# Altium schematic sheet ADCS&breakout_Board FinalVesion.schdoc
size 319 x 216 mm
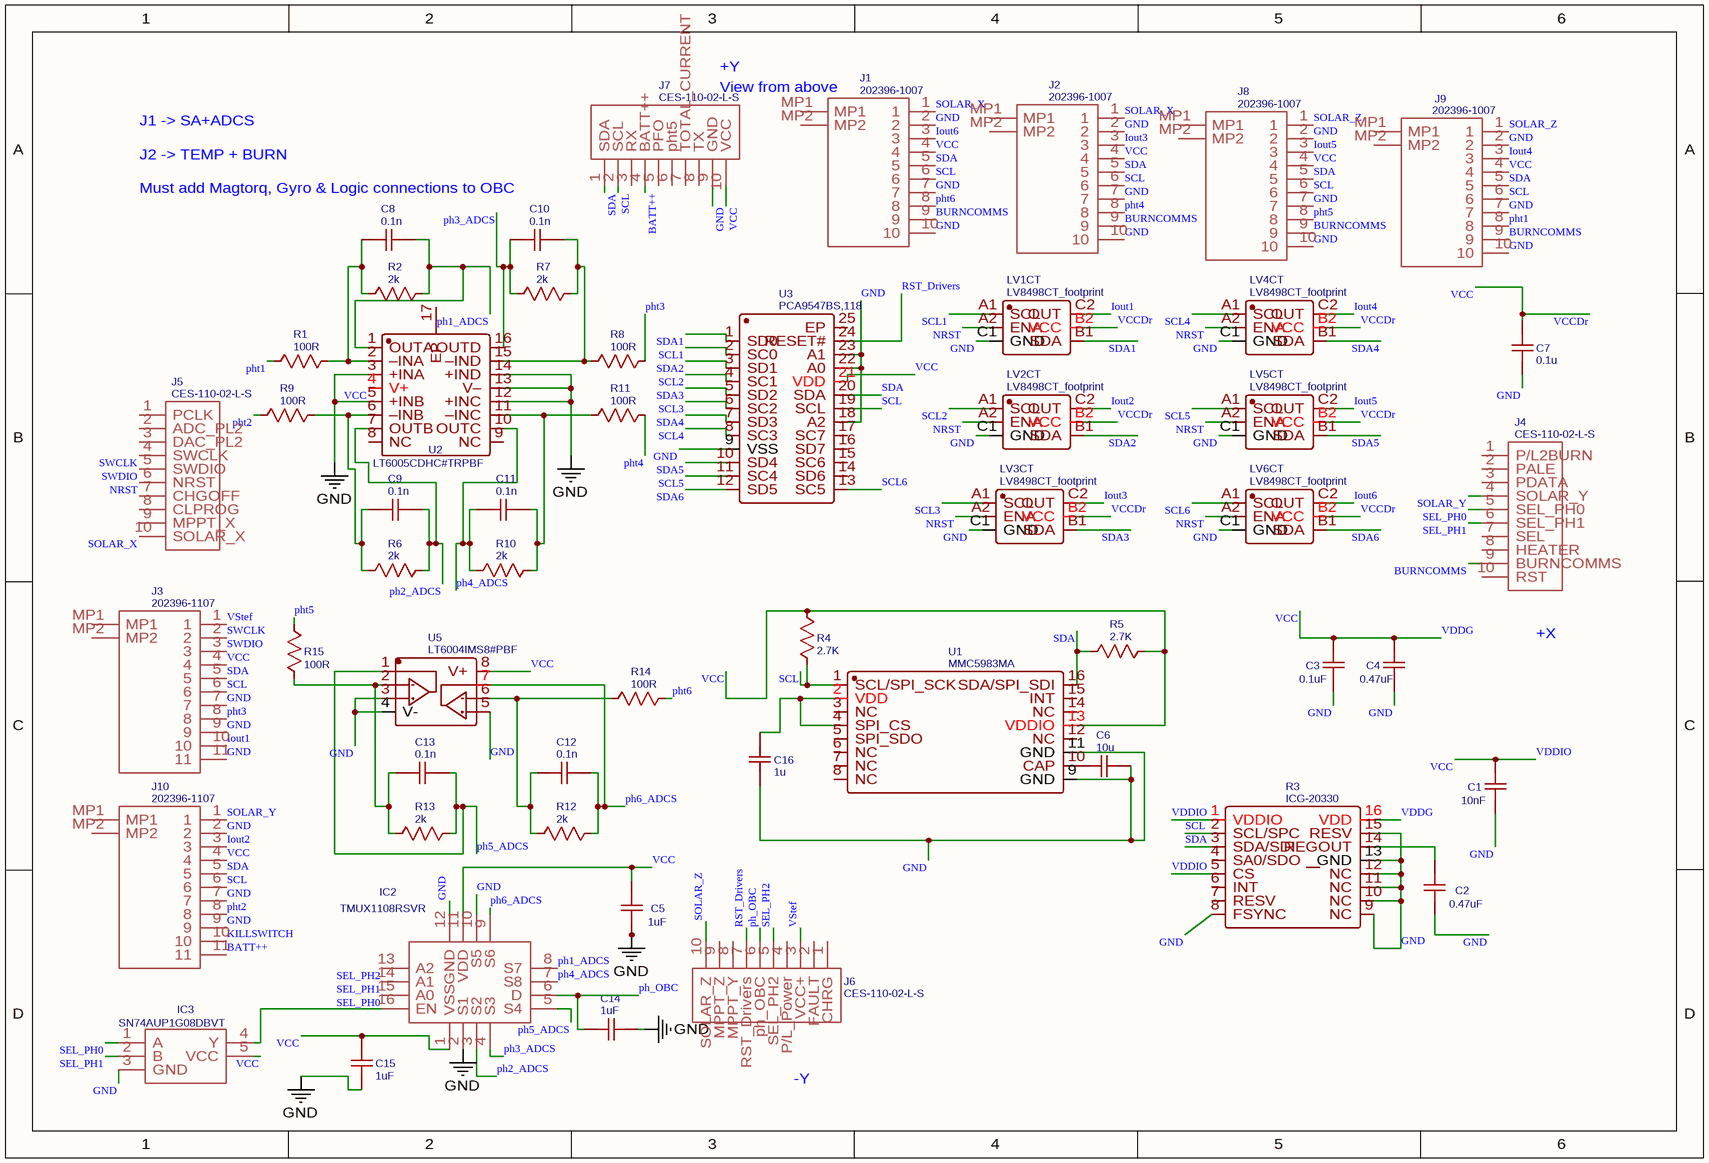
[diagram p0: ADCS&breakout_Board FinalVesion.schdoc]

## Parts
C1  10nF  [C0603]
C2  0.47uF  [C0603]
C3  0.1uF  [C0603]
C4  0.47uF  [C0603]
C5  1uF  [C0603]
C6  10u  [C0603]
C7  0.1u  [C0603]
C8  0.1n  [C0603]
C9  0.1n  [C0603]
C10  0.1n  [C0603]
C11  0.1n  [C0603]
C12  0.1n  [C0603]
C13  0.1n  [C0603]
C14  1uF  [C0603]
C15  1uF  [C0603]
C16  1u  [C0603]
IC2  TMUX1108RSVR  [QFN40P180X260X55-16N]
IC3  SN74AUP1G08DBVT  [SOT95P280X145-5N]
J1  202396-1007  [2023961007]
J2  202396-1007  [2023961007]
J3  202396-1107  [2023961107]
J4  CES-110-02-L-S  [CES-110-XX-Y-S]
J5  CES-110-02-L-S  [CES-110-XX-Y-S]
J6  CES-110-02-L-S  [CES-110-XX-Y-S]
J7  CES-110-02-L-S  [CES-110-XX-Y-S]
J8  202396-1007  [2023961007]
J9  202396-1007  [2023961007]
J10  202396-1107  [2023961107]
LV1CT  LV8498CT_footprint  [WLP-6_L1.30-W0.90-P0.40-TL]
LV2CT  LV8498CT_footprint  [WLP-6_L1.30-W0.90-P0.40-TL]
LV3CT  LV8498CT_footprint  [WLP-6_L1.30-W0.90-P0.40-TL]
LV4CT  LV8498CT_footprint  [WLP-6_L1.30-W0.90-P0.40-TL]
LV5CT  LV8498CT_footprint  [WLP-6_L1.30-W0.90-P0.40-TL]
LV6CT  LV8498CT_footprint  [WLP-6_L1.30-W0.90-P0.40-TL]
R1  100R  [R0603]
R2  2k  [R0603]
R3  ICG-20330  [LGA-16_L3.0-W3.0-P0.50-BL]
R4  2.7K  [R0603]
R5  2.7K  [R0603]
R6  2k  [R0603]
R7  2k  [R0603]
R8  100R  [R0603]
R9  100R  [R0603]
R10  2k  [R0603]
R11  100R  [R0603]
R12  2k  [R0603]
R13  2k  [R0603]
R14  100R  [R0603]
R15  100R  [R0603]
U1  MMC5983MA  [LGA-16_L3.0-W3.0-P0.50-BL_SQ]
U2  LT6005CDHC#TRPBF  [DFN-16_L5.0-W3.0-P0.50-BL-EP]
U3  PCA9547BS,118  [HVQFN-24_L4.0-W4.0-P0.50-BL-EP2.1]
U5  LT6004IMS8#PBF  [MOSP-8_L3.0-W3.0-P0.65-LS4.9-BL]

## Nets
GND: C1.1 C2.1 C3.1 C4.1 C5.1 C6.2 C7.2 C14.2 C15.2 C16.2 IC2.2(S1) IC2.10(S5) IC2.12(GND) IC3.3(GND) J1.2 J1.7 J1.10 J2.2 J2.7 J2.10 J3.7 J3.9 J3.11 J7.9(GND) J8.2 J8.7 J8.10 J9.2 J9.7 J9.10 J10.2 J10.7 J10.9 LV1CT.C1(GND) LV2CT.C1(GND) LV3CT.C1(GND) LV4CT.C1(GND) LV5CT.C1(GND) LV6CT.C1(GND) R3.8(FSYNC) R3.9(NC) R3.10(NC) R3.11(NC) R3.12(NC) R3.13(GND) R3.15(RESV) U1.9(GND) U1.11(GND) U2.3(+INA) U2.5(+INB) U2.12(+INC) U2.13(V–) U2.14(+IND) U3.9(VSS) U3.18(A2) U3.22(A0) U3.23(A1) U5.3(INA+) U5.4(V-) U5.5(INB+)
BATT++: J7.4(BATT++) J10.11
BURNCOMMS: J1.9 J2.9 J4.9(BURNCOMMS) J8.9 J9.9
Iout1: J3.10 LV1CT.C2(OUT)
Iout2: J10.3 LV2CT.C2(OUT)
Iout3: J2.3 LV3CT.C2(OUT)
Iout4: J9.3 LV4CT.C2(OUT)
Iout5: J8.3 LV5CT.C2(OUT)
Iout6: J1.3 LV6CT.C2(OUT)
KILLSWITCH: J10.10
NRST: J5.6(NRST) LV1CT.A2(ENA) LV2CT.A2(ENA) LV3CT.A2(ENA) LV4CT.A2(ENA) LV5CT.A2(ENA) LV6CT.A2(ENA)
ph1_ADCS: C8.2 IC2.8(S7) R2.1 U2.1(OUTA)
ph2_ADCS: C9.2 IC2.3(S2) R6.1 U2.7(OUTB)
ph3_ADCS: C10.1 IC2.4(S3) R7.2 U2.16(OUTD)
ph4_ADCS: C11.1 IC2.7(S8) R10.2 U2.10(OUTC)
ph5_ADCS: C13.2 IC2.5(S4) R13.1 U5.1(OUTA)
ph6_ADCS: C12.2 IC2.9(S6) R12.1 U5.7(OUTB)
ph_OBC: C14.1 IC2.6(D) J6.6(ph_OBC)
pht1: J9.8 R1.1
pht2: J10.8 R9.1
pht3: J3.8 R8.2
pht4: J2.8 R11.2
pht5: J8.8 R15.2
pht6: J1.8 R14.2
RST_Drivers: J6.7(RST_Drivers) U3.24(RESET#)
SCL: J1.6 J2.6 J3.6 J7.2(SCL) J8.6 J9.6 J10.6 R3.2 R4.1 U1.1(SCL/SPI_SCK) U3.19(SCL)
SCL1: LV1CT.A1(SCL) U3.2(SC0)
SCL2: LV2CT.A1(SCL) U3.4(SC1)
SCL3: LV3CT.A1(SCL) U3.6(SC2)
SCL4: LV4CT.A1(SCL) U3.8(SC3)
SCL5: LV5CT.A1(SCL) U3.11(SC4)
SCL6: LV6CT.A1(SCL) U3.13(SC5)
SDA: J1.5 J2.5 J3.5 J7.1(SDA) J8.5 J9.5 J10.5 R3.3(SDA/SDI) R5.2 U1.16(SDA/SPI_SDI) U3.20(SDA)
SDA1: LV1CT.B1(SDA) U3.1(SD0)
SDA2: LV2CT.B1(SDA) U3.3(SD1)
SDA3: LV3CT.B1(SDA) U3.5(SD2)
SDA4: LV4CT.B1(SDA) U3.7(SD3)
SDA5: LV5CT.B1(SDA) U3.10(SD4)
SDA6: LV6CT.B1(SDA) U3.12(SD5)
SEL_PH0: IC2.15(A0) IC3.1(A) J4.5(SEL_PH0)
SEL_PH1: IC2.14(A1) IC3.2(B) J4.6(SEL_PH1)
SEL_PH2: IC2.13(A2) J6.5(SEL_PH2)
SOLAR_X: J1.1 J2.1 J5.10(SOLAR_X)
SOLAR_Y: J4.4(SOLAR_Y) J10.1
SOLAR_Z: J6.10(SOLAR_Z) J8.1 J9.1
SWCLK: J3.2 J5.4(SWCLK)
SWDIO: J3.3 J5.5(SWDIO)
VCC: C1.2 C3.2 C4.2 C5.2 C7.1 C15.1 IC2.1(VSS) IC2.11(VDD) IC3.5(VCC) J1.4 J2.4 J3.4 J7.10(VCC) J8.4 J9.4 J10.4 LV1CT.B2(VCC) LV2CT.B2(VCC) LV3CT.B2(VCC) LV4CT.B2(VCC) LV5CT.B2(VCC) LV6CT.B2(VCC) R3.1(VDDIO) R3.5(CS) R3.16(VDD) R4.2 R5.1 U1.13(VDDIO) U2.4(V+) U3.21(VDD) U5.8(V+)  [also labelled VCCDr, VDDG, VDDIO]
VStef: J3.1 J6.3(VCC+)
NetC2_2: C2.2 R3.14(REGOUT)
NetC6_1: C6.1 U1.10(CAP)
NetC8_1: C8.1 R1.2 R2.2 U2.2(–INA)
NetC9_1: C9.1 R6.2 R9.2 U2.6(–INB)
NetC10_2: C10.2 R7.1 R8.1 U2.15(–IND)
NetC11_2: C11.2 R10.1 R11.1 U2.11(–INC)
NetC12_1: C12.1 R12.2 R14.1 U5.6(INB-)
NetC13_1: C13.1 R13.2 R15.1 U5.2(INA-)
NetC16_1: C16.1 U1.2(VDD) U1.4(SPI_CS)
NetIC2_16: IC2.16(EN) IC3.4(Y)

Not connected (* = marked no-connect by the designer): J1 MP1 MP2; J2 MP1 MP2; J3 MP1 MP2; J4 1(P/L2BURN) 2(PALE) 3(PDATA) 7(SEL) 8(HEATER) 10(RST); J5 1(PCLK) 2(ADC_PL2) 3(DAC_PL2) 7(CHGOFF) 8(CLPROG) 9(MPPT_X); J6 1(CHRG) 2(FAULT) 4(P/L_Power) 8(MPPT_Y) 9(MPPT_Z); J7 3(RX) 5(PFO) 6(pht5) 7(TOTAL_CURRENT) 8(TX); J8 MP1 MP2; J9 MP1 MP2; J10 MP1 MP2; R3 4(SA0/SDO) 6(INT) 7(RESV); U1 3(NC) 5(SPI_SDO) 6(NC) 7(NC) 8(NC) 12(NC) 14(NC) 15(INT); U2 8(NC) 9(NC) 17(EP); U3 14(SD6) 15(SC6) 16(SD7) 17(SC7) 25(EP)

## Notes on the sheet
- +Y
- (near J1) View from above
- J1 -> SA+ADCS
- J2 -> TEMP + BURN
- Must add Magtorq, Gyro & Logic connections to OBC
- +X
- -Y

## Library data of the parts
C1 = 10nF: nameAlias: Value(F); Contributor: LCEDA_Lib; spicePre: C; spiceSymbolName: C_0603_US
C2 C4 = 0.47uF: nameAlias: Value(F); Contributor: LCEDA_Lib; spicePre: C; spiceSymbolName: C_0603_US
C3 = 0.1uF: nameAlias: Value(F); Contributor: LCEDA_Lib; spicePre: C; spiceSymbolName: C_0603_US
C5 C14 C15 = 1uF: nameAlias: Value(F); Contributor: LCEDA_Lib; spicePre: C; spiceSymbolName: C_0603_US
C6 = 10u: nameAlias: Value(F); Contributor: LCEDA_Lib; spicePre: C; spiceSymbolName: C_0603_US
C7 = 0.1u: nameAlias: Value(F); Contributor: LCEDA_Lib; spicePre: C; spiceSymbolName: C_0603_US
C8-C13 = 0.1n: nameAlias: Value(F); Contributor: LCEDA_Lib; spicePre: C; spiceSymbolName: C_0603_US
C16 = 1u: nameAlias: Value(F); Contributor: LCEDA_Lib; spicePre: C; spiceSymbolName: C_0603_US
IC2 = TMUX1108RSVR: Contributor: Pol Gimenez; spicePre: I; spiceSymbolName: TMUX1108RSVR
IC3 = SN74AUP1G08DBVT: Contributor: Pol Gimenez; spicePre: I; spiceSymbolName: SN74AUP1G08DBVT
J1 J2 J8 J9 = 202396-1007: Contributor: Pol Gimenez; spicePre: J; spiceSymbolName: 202396-1007
J3 J10 = 202396-1107: Contributor: Pol Gimenez; spicePre: J; spiceSymbolName: 202396-1107
J4-J7 = CES-110-02-L-S: Contributor: George-vlad Enache; spicePre: J; spiceSymbolName: CES-110-02-L-S
LV1CT LV2CT LV3CT LV4CT LV5CT LV6CT = LV8498CT_footprint: BOM_Manufacturer: ON semiconductor; BOM_Manufacturer Part: LV8498CT-TE-L-H; Contributor: Miguel Diaz Montiel; BOM_Supplier Part: 863-LV8498CT-TE-L-H; BOM_Supplier: Mouser; link: https://www.mouser.es/datasheet/2/308/1/ENA1625_D-2310969.pdf; spicePre: L; spiceSymbolName: LV8498CT_footprint
R1 R8 R9 R11 R14 R15 = 100R: nameAlias: Value(Ω); Contributor: LCEDA_Lib; spicePre: R; spiceSymbolName: R_0603_US
R2 R6 R7 R10 R12 R13 = 2k: nameAlias: Value(Ω); Contributor: LCEDA_Lib; spicePre: R; spiceSymbolName: R_0603_US
R3 = ICG-20330: BOM_Manufacturer: TDK InvenSense(应美盛); Contributor: LCSC; BOM_Supplier: LCSC; BOM_Supplier Part: C2655094; BOM_Manufacturer Part: ICG-20330; BOM_JLCPCB Part Class: Extended Part; spicePre: R; spiceSymbolName: ICG-20330
R4 R5 = 2.7K: nameAlias: Value(Ω); Contributor: LCEDA_Lib; spicePre: R; spiceSymbolName: R_0603_US
U1 = MMC5983MA: BOM_Manufacturer: MEMSIC; Contributor: LCSC; BOM_Supplier: LCSC; BOM_Supplier Part: C404329; BOM_Manufacturer Part: MMC5983MA; BOM_JLCPCB Part Class: Extended Part; spicePre: U; spiceSymbolName: MMC5983MA
U2 = LT6005CDHC#TRPBF: BOM_Manufacturer: Analog Devices; Contributor: LCSC; BOM_Supplier: LCSC; BOM_Supplier Part: C672687; BOM_Manufacturer Part: LT6005CDHC#TRPBF; BOM_JLCPCB Part Class: Extended Part; spicePre: U; spiceSymbolName: LT6005CDHC#TRPBF
U3 = PCA9547BS,118: BOM_Manufacturer: NXP(恩智浦); Contributor: LCSC; BOM_Supplier: LCSC; BOM_Supplier Part: C2652947; BOM_Manufacturer Part: PCA9547BS,118; BOM_JLCPCB Part Class: Extended Part; spicePre: U; spiceSymbolName: PCA9547BS,118
U5 = LT6004IMS8#PBF: BOM_Manufacturer: Linear Tech; Contributor: LCSC; BOM_Supplier: LCSC; BOM_Supplier Part: C117424; BOM_Manufacturer Part: LT6004IMS8#PBF; BOM_JLCPCB Part Class: Extended Part; spicePre: U; spiceSymbolName: LT6004IMS8#PBF